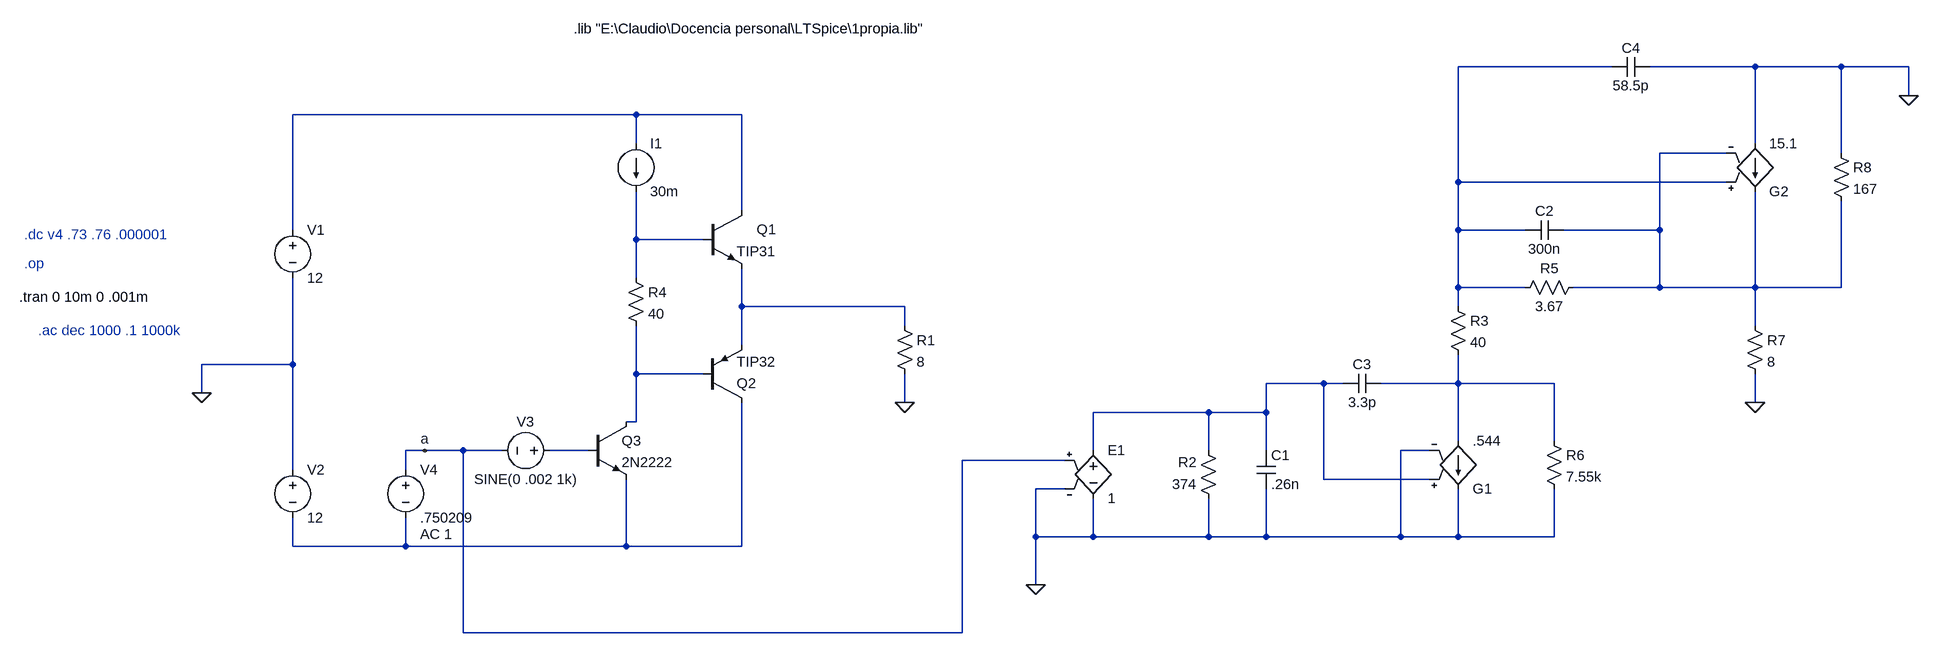
[diagram p0: schematic clase ab respuesta en frecuencia c.asc]
clase ab respuesta en frecuencia c.asc, the LTspice schematic file:
Version 4
SHEET 1 2388 1028
WIRE 1760 80 1504 80
WIRE 2112 80 1824 80
WIRE 2256 80 2112 80
WIRE 2368 80 2256 80
WIRE 2368 128 2368 80
WIRE 112 160 -512 160
WIRE 288 160 112 160
WIRE 112 208 112 160
WIRE 2112 208 2112 80
WIRE 2064 224 1840 224
WIRE 2256 224 2256 80
WIRE 1504 272 1504 80
WIRE 2064 272 1504 272
WIRE 288 320 288 160
WIRE -512 352 -512 160
WIRE 1504 352 1504 272
WIRE 1616 352 1504 352
WIRE 1840 352 1840 224
WIRE 1840 352 1680 352
WIRE 112 368 112 288
WIRE 224 368 112 368
WIRE 112 432 112 368
WIRE 1504 448 1504 352
WIRE 1616 448 1504 448
WIRE 1840 448 1840 352
WIRE 1840 448 1696 448
WIRE 2112 448 2112 288
WIRE 2112 448 1840 448
WIRE 2256 448 2256 304
WIRE 2256 448 2112 448
WIRE 288 480 288 416
WIRE 560 480 288 480
WIRE 1504 480 1504 448
WIRE 560 512 560 480
WIRE 2112 512 2112 448
WIRE 288 544 288 480
WIRE -512 576 -512 432
WIRE -512 576 -672 576
WIRE 112 592 112 512
WIRE 224 592 112 592
WIRE 1280 608 1184 608
WIRE 1312 608 1280 608
WIRE 1504 608 1504 560
WIRE 1504 608 1376 608
WIRE 1664 608 1504 608
WIRE -672 624 -672 576
WIRE 560 640 560 592
WIRE 2112 640 2112 592
WIRE 1088 656 896 656
WIRE 1184 656 1184 608
WIRE 1184 656 1088 656
WIRE 112 672 112 592
WIRE 112 672 96 672
WIRE 1504 704 1504 608
WIRE 1664 704 1664 608
WIRE -240 720 -272 720
WIRE -176 720 -240 720
WIRE -112 720 -176 720
WIRE 32 720 -32 720
WIRE 896 720 896 656
WIRE 1088 720 1088 656
WIRE 1184 720 1184 656
WIRE 1456 720 1408 720
WIRE 848 736 656 736
WIRE -512 752 -512 576
WIRE -272 752 -272 720
WIRE 1280 768 1280 608
WIRE 1456 768 1280 768
WIRE 848 784 800 784
WIRE 800 864 800 784
WIRE 896 864 896 800
WIRE 896 864 800 864
WIRE 1088 864 1088 800
WIRE 1088 864 896 864
WIRE 1184 864 1184 784
WIRE 1184 864 1088 864
WIRE 1408 864 1408 720
WIRE 1408 864 1184 864
WIRE 1504 864 1504 784
WIRE 1504 864 1408 864
WIRE 1664 864 1664 784
WIRE 1664 864 1504 864
WIRE -512 880 -512 832
WIRE -272 880 -272 832
WIRE -272 880 -512 880
WIRE 96 880 96 768
WIRE 96 880 -272 880
WIRE 288 880 288 640
WIRE 288 880 96 880
WIRE 800 944 800 864
WIRE -176 1024 -176 720
WIRE 656 1024 656 736
WIRE 656 1024 -176 1024
FLAG -672 624 0
FLAG 560 640 0
FLAG 800 944 0
FLAG 2112 640 0
FLAG 2368 128 0
FLAG -240 720 a
DATAFLAG 560 480 ""
DATAFLAG 160 368 ""
DATAFLAG 208 592 ""
SYMBOL npn 224 320 R0
WINDOW 0 89 31 Left 2
SYMATTR InstName Q1
SYMATTR Value TIP31
SYMBOL pnp 224 640 M180
SYMATTR InstName Q2
SYMATTR Value TIP32
SYMBOL voltage -512 336 R0
WINDOW 123 0 0 Left 0
WINDOW 39 0 0 Left 0
SYMATTR InstName V1
SYMATTR Value 12
SYMBOL voltage -512 736 R0
WINDOW 123 0 0 Left 0
WINDOW 39 0 0 Left 0
SYMATTR InstName V2
SYMATTR Value 12
SYMBOL res 544 496 R0
SYMATTR InstName R1
SYMATTR Value 8
SYMBOL npn 32 672 R0
SYMATTR InstName Q3
SYMATTR Value 2N2222
SYMBOL voltage -16 720 R90
WINDOW 0 -32 56 VBottom 2
WINDOW 3 32 56 VTop 2
WINDOW 123 0 0 Left 0
WINDOW 39 0 0 Left 0
SYMATTR InstName V3
SYMATTR Value SINE(0 .002 1k)
SYMBOL voltage -272 736 R0
WINDOW 123 24 124 Left 2
WINDOW 39 0 0 Left 0
SYMATTR Value2 AC 1
SYMATTR InstName V4
SYMATTR Value .750209
SYMBOL res 96 416 R0
SYMATTR InstName R4
SYMATTR Value 40
SYMBOL current 112 208 R0
WINDOW 123 0 0 Left 0
WINDOW 39 0 0 Left 0
SYMATTR InstName I1
SYMATTR Value 30m
SYMBOL res 1104 816 R180
WINDOW 0 36 76 Left 2
WINDOW 3 36 40 Left 2
SYMATTR InstName R2
SYMATTR Value 374
SYMBOL cap 1168 720 R0
SYMATTR InstName C1
SYMATTR Value .26n
SYMBOL g 1504 800 M180
SYMATTR InstName G1
SYMATTR Value .544
SYMBOL res 1712 432 R90
WINDOW 0 0 56 VBottom 2
WINDOW 3 32 56 VTop 2
SYMATTR InstName R5
SYMATTR Value 3.67
SYMBOL cap 1680 336 R90
WINDOW 0 0 32 VBottom 2
WINDOW 3 32 32 VTop 2
SYMATTR InstName C2
SYMATTR Value 300n
SYMBOL res 1648 688 R0
SYMATTR InstName R6
SYMATTR Value 7.55k
SYMBOL cap 1376 592 R90
WINDOW 0 0 32 VBottom 2
WINDOW 3 32 32 VTop 2
SYMATTR InstName C3
SYMATTR Value 3.3p
SYMBOL res 2096 496 R0
SYMATTR InstName R7
SYMATTR Value 8
SYMBOL g 2112 304 M180
SYMATTR InstName G2
SYMATTR Value 15.1
SYMBOL cap 1824 64 R90
WINDOW 0 0 32 VBottom 2
WINDOW 3 32 32 VTop 2
SYMATTR InstName C4
SYMATTR Value 58.5p
SYMBOL res 2240 208 R0
SYMATTR InstName R8
SYMATTR Value 167
SYMBOL e 896 704 R0
SYMATTR InstName E1
SYMATTR Value 1
SYMBOL res 1488 464 R0
SYMATTR InstName R3
SYMATTR Value 40
TEXT 8 16 Left 2 !.lib "E:\\Claudio\\Docencia personal\\LTSpice\\1propia.lib"
TEXT -976 464 Left 2 !.tran 0 10m 0 .001m
TEXT -968 408 Left 2 ;.op
TEXT -968 360 Left 2 ;.dc v4 .73 .76 .000001
TEXT -944 520 Left 2 ;.ac dec 1000 .1 1000k

The netlist it stands for:
* clase ab respuesta en frecuencia c.asc
Q1 N002 N004 N005 0 TIP31
Q2 N010 N006 N005 0 TIP32
V1 N002 0 12
V2 0 N010 12
R1 N005 0 8
Q3 N006 N009 N010 0 2N2222
V3 N009 a SINE(0 .002 1k)
V4 a N010 .750209 AC 1
R4 N004 N006 40
I1 N002 N004 30m
R2 0 N007 374
C1 N007 0 .26n
G1 N008 0 N007 0 .544
R5 N003 N001 3.67
C2 N003 N001 300n
R6 N008 0 7.55k
C3 N008 N007 3.3p
R7 N003 0 8
G2 0 N003 N001 N003 15.1
C4 0 N001 58.5p
R8 0 N003 167
E1 N007 0 a 0 1
R3 N001 N008 40
.model NPN NPN
.model PNP PNP
.lib standard.bjt
.lib "E:\Claudio\Docencia personal\LTSpice\1propia.lib"
.tran 0 10m 0 .001m
* .op
* .dc v4 .73 .76 .000001
* .ac dec 1000 .1 1000k
.backanno
.end